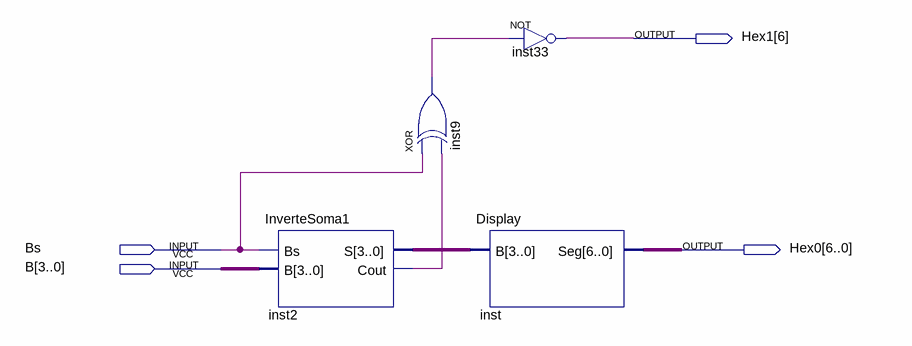
[diagram p0: schematic sheet]
// Quartus schematic DisplayDe4BitsComSinal.bdf as structural Verilog: 4 symbols, 4 pins
module DisplayDe4BitsComSinal (
  input  Bs,
  input  [3:0] B,
  output [6:6] Hex1,
  output [6:0] Hex0
);

  wire inst2_cout, inst9_out;
  wire [3:0] inst2_s;

  InverteSoma1 inst2 (.Bs(Bs), .B(B), .S(inst2_s), .Cout(inst2_cout));
  xor inst9 (inst9_out, Bs, inst2_cout);
  not inst33 (Hex1[6], inst9_out);
  Display inst (.B(inst2_s), .Seg(Hex0));
endmodule
